# Altium project FireworkC3_pcb.PrjPcb
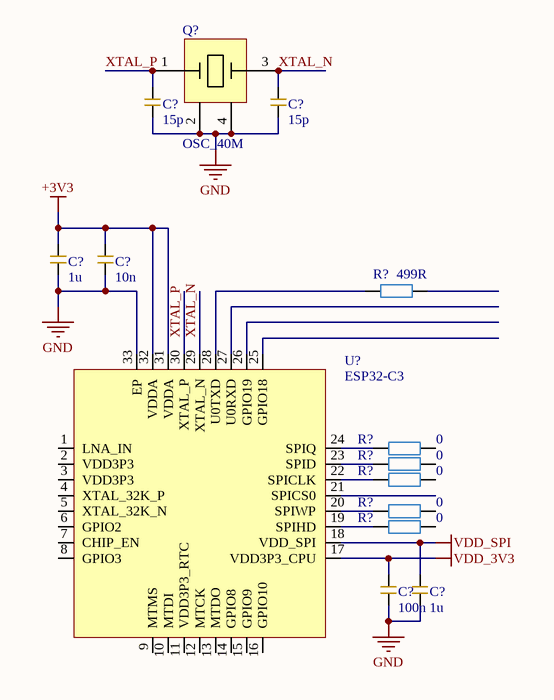
[diagram p0: mcu.SchDoc]
1 sheet, 14 parts. Net scope: global (net labels, ports and power ports of the same name join across sheets).
Board file: driver.PcbDoc

## Sheet mcu.SchDoc
size A3; SheetNumber: 1; SheetTotal: 1

### Parts
(Parts that share a designator on the sheet are numbered #1, #2 ... from top to bottom, then left to right.)
C?#1  15p  [CAP_0603]
C?#2  15p  [CAP_0603]
C?#3  1u  [CAP_0603]
C?#4  10n  [CAP_0603]
C?#5  100n  [CAP_0603]
C?#6  1u  [CAP_0603]
Q?  OSC_40M  [OSC_40M]
R?#1  499R  [RES_0603]
R?#2  0  [RES_0603]
R?#3  0  [RES_0603]
R?#4  0  [RES_0603]
R?#5  0  [RES_0603]
R?#6  0  [RES_0603]
U?  ESP32-C3  [ESP32-C3]

### Nets
+3V3: C?#3.2 C?#4.2 U?.31(VDDA) U?.32(VDDA)
GND: C?#1.1 C?#2.1 C?#3.1 C?#4.1 C?#5.1 C?#6.1 Q?.2 Q?.4 U?.33(EP)
VDD_3V3: C?#5.2 U?.17(VDD3P3_CPU)
VDD_SPI: C?#6.2 U?.18(VDD_SPI)
XTAL_N: C?#2.2 Q?.3 U?.29(XTAL_N)
XTAL_P: C?#1.2 Q?.1 U?.30(XTAL_P)
NetR?#1_1: R?#1.1 U?.28(U0TXD)
NetR?#2_1: R?#2.1 U?.24(SPIQ)
NetR?#3_1: R?#3.1 U?.23(SPID)
NetR?#4_1: R?#4.1 U?.22(SPICLK)
NetR?#5_1: R?#5.1 U?.20(SPIWP)
NetR?#6_1: R?#6.1 U?.19(SPIHD)

Not connected (* = marked no-connect by the designer): R?#1 2; R?#2 2; R?#3 2; R?#4 2; R?#5 2; R?#6 2; U? 1(LNA_IN) 2(VDD3P3) 3(VDD3P3) 4(XTAL_32K_P) 5(XTAL_32K_N) 6(GPIO2) 7(CHIP_EN) 8(GPIO3) 9(MTMS) 10(MTDI) 11(VDD3P3_RTC) 12(MTCK) 13(MTDO) 14(GPIO8) 15(GPIO9) 16(GPIO10) 21(SPICS0) 25(GPIO18) 26(GPIO19) 27(U0RXD)

### Library data of the parts
C?#1-C?#6 = CAP_0603: Capacitor SMD 0603 Generic; Manufacturer: *; Voltage Rating: *; Package: 0603
Q? = OSC_40M: 40MHz 15pF ±10ppm SMD3225-4P Crystals ROHS; Mfr. Part: TZ0475B; LCSC: C501793
R?#1-R?#6 = RES_0603: Resistor SMD 0603 Generic; Manufacturer: *; Voltage Rating: *; Power Rating: *; Package: 0603
U? = ESP32-C3: 400KB 22 3V~3.6V RISC-V 160MHz QFN-32-EP(5x5) Microcontrollers (MCU/MPU/SOC) ROHS; LCSC: C2838500; Mfr. Part: ESP32-C3